# EAGLE design MultiGRADE_control_panel_V01_R1 (EAGLE 9.6.2)
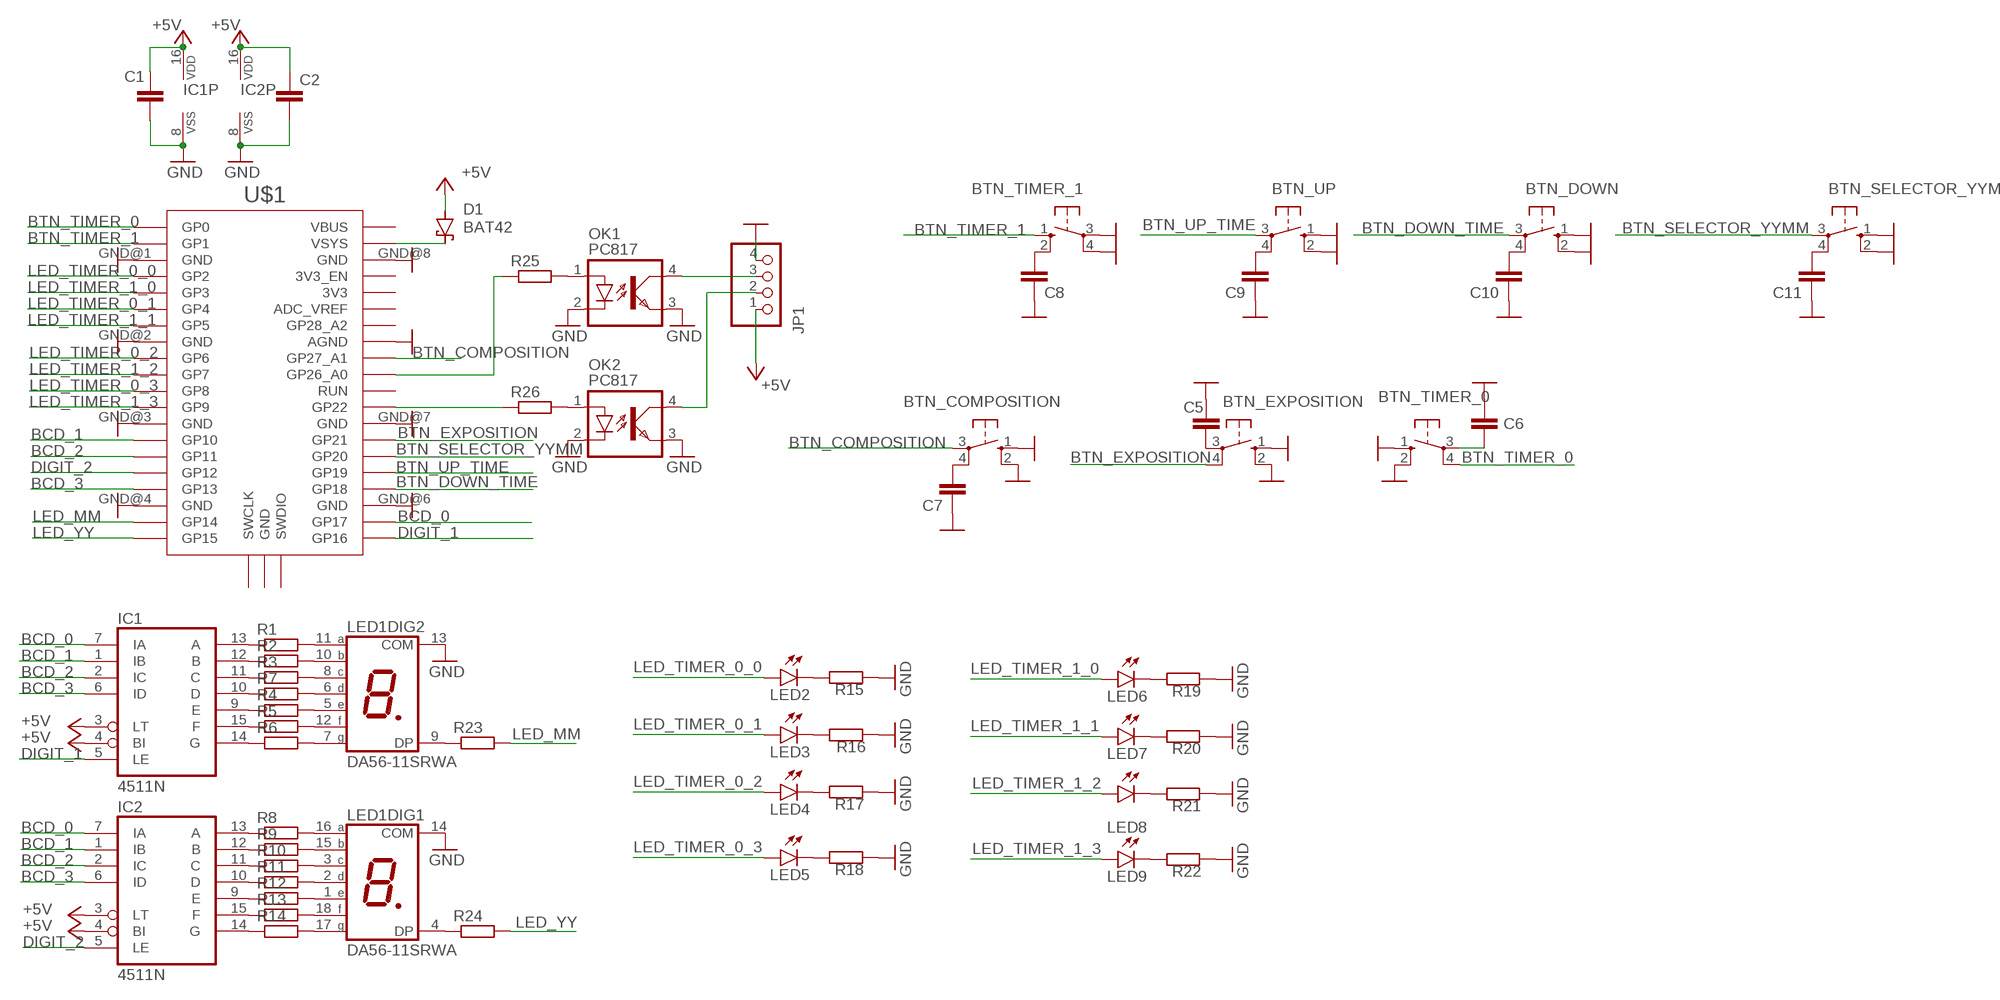
[diagram p0: schematic, sheet 1]

## Parts
BTN_COMPOSITION  10-XX  [B3F-10XX]
BTN_DOWN  10-XX  [B3F-10XX]
BTN_EXPOSITION  10-XX  [B3F-10XX]
BTN_SELECTOR_YYMM  10-XX  [B3F-10XX]
BTN_TIMER_0  10-XX  [B3F-10XX]
BTN_TIMER_1  10-XX  [B3F-10XX]
BTN_UP  10-XX  [B3F-10XX]
C1  C-EU050-025X075  [C050-025X075]
C2  C-EU050-025X075  [C050-025X075]
C5  C-EU025-025X050  [C025-025X050]
C6  C-EU025-025X050  [C025-025X050]
C7  C-EU025-025X050  [C025-025X050]
C8  C-EU025-025X050  [C025-025X050]
C9  C-EU025-025X050  [C025-025X050]
C10  C-EU025-025X050  [C025-025X050]
C11  C-EU025-025X050  [C025-025X050]
D1  BAT42  [DO35-10]
IC1  4511N  [DIL16]
IC2  4511N  [DIL16]
JP1  PINHD-1X4  [1X04]
LED1  DA56-11SRWA  [DA56]
LED2  LED3MM  [LED3MM]
LED3  LED3MM  [LED3MM]
LED4  LED3MM  [LED3MM]
LED5  LED3MM  [LED3MM]
LED6  LED3MM  [LED3MM]
LED7  LED3MM  [LED3MM]
LED8  LED3MM  [LED3MM]
LED9  LED3MM  [LED3MM]
OK1  PC817  [DIL04]
OK2  PC817  [DIL04]
R1  R-EU_0204/7  [0204/7]
R2  R-EU_0204/7  [0204/7]
R3  R-EU_0204/7  [0204/7]
R4  R-EU_0204/7  [0204/7]
R5  R-EU_0204/7  [0204/7]
R6  R-EU_0204/7  [0204/7]
R7  R-EU_0204/7  [0204/7]
R8  R-EU_0204/7  [0204/7]
R9  R-EU_0204/7  [0204/7]
R10  R-EU_0204/7  [0204/7]
R11  R-EU_0204/7  [0204/7]
R12  R-EU_0204/7  [0204/7]
R13  R-EU_0204/7  [0204/7]
R14  R-EU_0204/7  [0204/7]
R15  R-EU_0204/7  [0204/7]
R16  R-EU_0204/7  [0204/7]
R17  R-EU_0204/7  [0204/7]
R18  R-EU_0204/7  [0204/7]
R19  R-EU_0204/7  [0204/7]
R20  R-EU_0204/7  [0204/7]
R21  R-EU_0204/7  [0204/7]
R22  R-EU_0204/7  [0204/7]
R23  R-EU_0204/7  [0204/7]
R24  R-EU_0204/7  [0204/7]
R25  R-EU_0204/7  [0204/7]
R26  R-EU_0204/7  [0204/7]
U$1  RPI_PICO_IG-TH  [RPI_PICO_TH]

## Nets
+5V: C1.1 C2.1 D1.A IC1.3(LT) IC1.4(BI) IC1.16(VDD) IC2.3(LT) IC2.4(BI) IC2.16(VDD) JP1.1
BCD_0: IC1.7(IA) IC2.7(IA) U$1.GP17
BCD_1: IC1.1(IB) IC2.1(IB) U$1.GP10
BCD_2: IC1.2(IC) IC2.2(IC) U$1.GP11
BCD_3: IC1.6(ID) IC2.6(ID) U$1.GP13
BTN_COMPOSITION: BTN_COMPOSITION.3(P) U$1.GP27_A1
BTN_DOWN_TIME: BTN_DOWN.3(P) U$1.GP18
BTN_EXPOSITION: BTN_EXPOSITION.4(P1) U$1.GP21
BTN_SELECTOR_YYMM: BTN_SELECTOR_YYMM.3(P) U$1.GP20
BTN_TIMER_0: BTN_TIMER_0.4(P1) U$1.GP0
BTN_TIMER_1: BTN_TIMER_1.1(S) U$1.GP1
BTN_UP_TIME: BTN_UP.3(P) U$1.GP19
DIGIT_1: IC1.5(LE) U$1.GP16
DIGIT_2: IC2.5(LE) U$1.GP12
GND: BTN_COMPOSITION.1(S) BTN_COMPOSITION.2(S1) BTN_DOWN.1(S) BTN_DOWN.2(S1) BTN_EXPOSITION.1(S) BTN_EXPOSITION.2(S1) BTN_SELECTOR_YYMM.1(S) BTN_SELECTOR_YYMM.2(S1) BTN_TIMER_0.1(S) BTN_TIMER_0.2(S1) BTN_TIMER_1.3(P) BTN_TIMER_1.4(P1) BTN_UP.1(S) BTN_UP.2(S1) C1.2 C2.2 C5.1 C6.1 C7.1 C8.1 C9.1 C10.1 C11.1 IC1.8(VSS) IC2.8(VSS) JP1.4 LED1.13(DIG2:COM) LED1.14(DIG1:COM) OK1.2(C) OK1.3(EMIT) OK2.2(C) OK2.3(EMIT) R15.1 R16.1 R17.1 R18.1 R19.1 R20.1 R21.1 R22.1 U$1.AGND U$1.GND@1(GND) U$1.GND@2(GND) U$1.GND@3(GND) U$1.GND@4(GND) U$1.GND@6(GND) U$1.GND@7(GND) U$1.GND@8(GND)
LED_MM: R23.2 U$1.GP14
LED_TIMER_0_0: LED2.A U$1.GP2
LED_TIMER_0_1: LED3.A U$1.GP4
LED_TIMER_0_2: LED4.A U$1.GP6
LED_TIMER_0_3: LED5.A U$1.GP8
LED_TIMER_1_0: LED6.A U$1.GP3
LED_TIMER_1_1: LED7.A U$1.GP5
LED_TIMER_1_2: LED8.A U$1.GP7
LED_TIMER_1_3: LED9.A U$1.GP9
LED_YY: R24.2 U$1.GP15
N$1: IC1.13(A) R1.1
N$2: IC1.11(C) R3.1
N$3: IC1.15(F) R5.1
N$4: IC1.14(G) R6.1
N$5: IC1.10(D) R7.1
N$6: IC2.13(A) R8.1
N$7: IC2.12(B) R9.1
N$8: IC2.11(C) R10.1
N$9: IC2.10(D) R11.1
N$10: IC2.9(E) R12.1
N$11: IC2.15(F) R13.1
N$12: IC2.14(G) R14.1
N$13: LED1.16(DIG1:A) R8.2
N$14: LED1.15(DIG1:B) R9.2
N$15: LED1.3(DIG1:C) R10.2
N$16: LED1.2(DIG1:D) R11.2
N$17: LED1.1(DIG1:E) R12.2
N$18: LED1.18(DIG1:F) R13.2
N$19: LED1.17(DIG1:G) R14.2
N$20: IC1.9(E) R4.1
N$21: IC1.12(B) R2.1
N$22: LED1.11(DIG2:A) R1.2
N$23: LED1.10(DIG2:B) R2.2
N$24: LED1.8(DIG2:C) R3.2
N$25: LED1.5(DIG2:E) R4.2
N$26: LED1.12(DIG2:F) R5.2
N$27: LED1.7(DIG2:G) R6.2
N$28: LED1.6(DIG2:D) R7.2
N$29: LED2.K(C) R15.2
N$30: LED1.9(DIG2:DP) R23.1
N$31: BTN_EXPOSITION.3(P) C5.2
N$32: BTN_TIMER_0.3(P) C6.2
N$33: BTN_COMPOSITION.4(P1) C7.2
N$34: BTN_TIMER_1.2(S1) C8.2
N$35: BTN_UP.4(P1) C9.2
N$36: BTN_DOWN.4(P1) C10.2
N$37: BTN_SELECTOR_YYMM.4(P1) C11.2
N$38: LED1.4(DIG1:DP) R24.1
N$39: R25.1 U$1.GP26_A0
N$40: OK1.1(A) R25.2
N$41: OK2.1(A) R26.2
N$42: JP1.3 OK1.4(COL)
N$43: JP1.2 OK2.4(COL)
N$44: R26.1 U$1.GP22
N$45: D1.C U$1.VSYS
N$46: LED3.K(C) R16.2
N$47: LED4.K(C) R17.2
N$48: LED5.K(C) R18.2
N$49: LED6.K(C) R19.2
N$50: LED7.K(C) R20.2
N$51: LED8.K(C) R21.2
N$52: LED9.K(C) R22.2
Unconnected: U$1.3V3 U$1.3V3_EN U$1.ADC_VREF U$1.GND@5(GND) U$1.GP28_A2 U$1.RUN U$1.SWCLK U$1.SWDIO U$1.VBUS

## Library data of the parts
BTN_COMPOSITION BTN_DOWN BTN_EXPOSITION BTN_SELECTOR_YYMM BTN_TIMER_0 BTN_TIMER_1 BTN_UP = switch-omron:10-XX: OMRON SWITCH; MPN: B3F-1000; OC_FARNELL: 176432; OC_NEWARK: 36M3542
C1 C2 C5-C11 = rcl:C-EU: CAPACITOR, European symbol; SPICEPREFIX: C
D1 = diode:BAT42: DIODE barrier diode
IC1 IC2 = 45xx:4511: BCD to 7-segment LATCH/DECODER/DRIVER
JP1 = pinhead:PINHD-1X4: PIN HEADER
LED1 = display-kingbright:DA56-11: 14.22mm (0.56INCH) DUAL DIGIT NUMERIC DISPLAYS Source: www.kingbright.com .. DA56-11SRWA.pdf; OC_FARNELL: unknown; OC_NEWARK: unknown
LED2-LED9 = led:LED: LED OSRAM: - CHIPLED LG R971, LG N971, LY N971, LG Q971, LY Q971, LO R971, LY R971 LH N974, LH R974 LS Q976, LO Q976, LY Q976 LO Q996 - Hyper CHIPLED LW Q18S LB Q993, LB Q99A, LB R99A - SideLED LS A670, LO A670, LY A670, LG A670, LP A670 LB A673, LV A673, LT A673, LW A673 LH A674 LY A675 LS A676, LA A676, LO A676, LY A676, LW A676 LS A679, LY A679, LG A679 - Hyper Micro SIDELED® LS Y876, LA Y876, LO Y876, LY Y876 LT Y87S - SmartLED LW L88C, LW L88S LB L89C, LB L89S, LG L890 LS L89K, LO L89K, LY L89K LS L896, LA L896, LO L896, LY L896 - TOPLED LS T670, LO T670, LY T670, LG T670, LP T670 LSG T670, LSP T670, LSY T670, LOP T670, LYG T670 LG T671, LOG T671, LSG T671 LB T673, LV T673, LT T673, LW T673 LH T674 LS T676, LA T676, LO T676, LY T676, LB T676, LH T676, LSB T676, LW T676 LB T67C, LV T67C, LT T67C, LS T67K, LO T67K, LY T67K, LW E67C LS E67B, LA E67B, LO E67B, LY E67B, LB E67C, LV E67C, LT E67C LW T67C LS T679, LY T679, LG T679 LS T770, LO T770, LY T770, LG T770, LP T770 LB T773, LV T773, LT T773, LW T773 LH T774 LS E675, LA E675, LY E675, LS T675 LS T776, LA T776, LO T776, LY T776, LB T776 LHGB T686 LT T68C, LB T68C - Hyper Mini TOPLED® LB M676 - Mini TOPLED Santana® LG M470 LS M47K, LO M47K, LY M47K Source: http://www.osram.convergy.de LUXEON: - LUMILED® LXK2-PW12-R00, LXK2-PW12-S00, LXK2-PW14-U00, LXK2-PW14-V00 LXK2-PM12-R00, LXK2-PM12-S00, LXK2-PM14-U00 LXK2-PE12-Q00, LXK2-PE12-R00, LXK2-PE12-S00, LXK2-PE14-T00, LXK2-PE14-U00 LXK2-PB12-K00, LXK2-PB12-L00, LXK2-PB12-M00, LXK2-PB14-N00, LXK2-PB14-P00, LXK2-PB14-Q00 LXK2-PR12-L00, LXK2-PR12-M00, LXK2-PR14-Q00, LXK2-PR14-R00 LXK2-PD12-Q00, LXK2-PD12-R00, LXK2-PD12-S00 LXK2-PH12-R00, LXK2-PH12-S00 LXK2-PL12-P00, LXK2-PL12-Q00, LXK2-PL12-R00 Source: www.luxeon.com KINGBRIGHT: KA-3528ASYC Source: www.kingbright.com
OK1 OK2 = optocoupler:PC817: SHARP OPTO COUPLER; MPN: PC817X4J000F; OC_FARNELL: 9707727; OC_NEWARK: 97K7059
R1-R26 = rcl:R-EU_: RESISTOR, European symbol; SPICEPREFIX: R
U$1 = RaspberryPi_Pico:RPI_PICO_IG

## Board
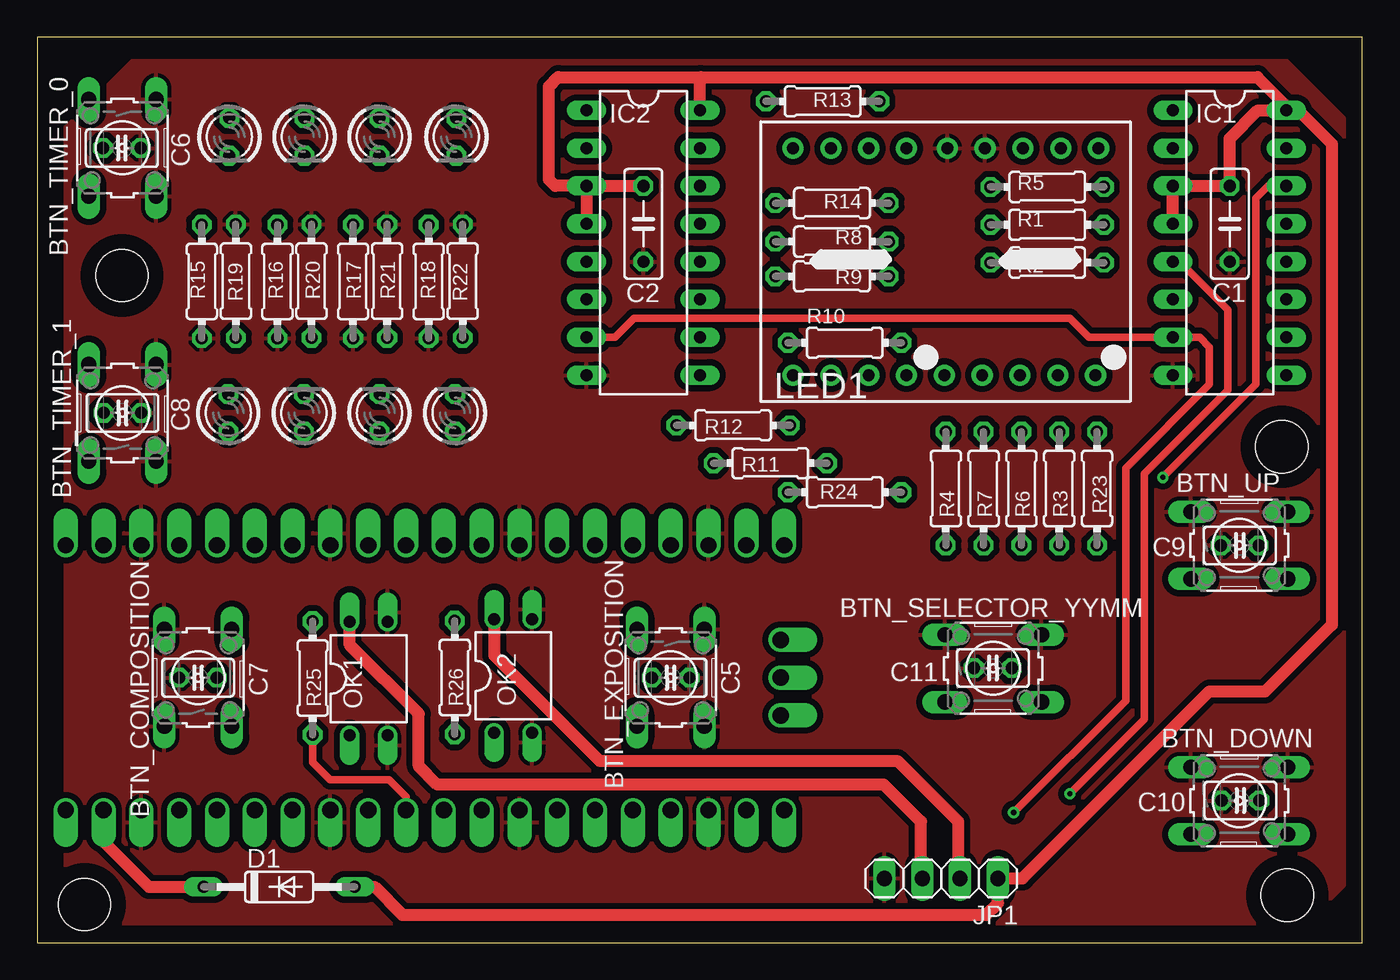
[diagram p1: board, top side]
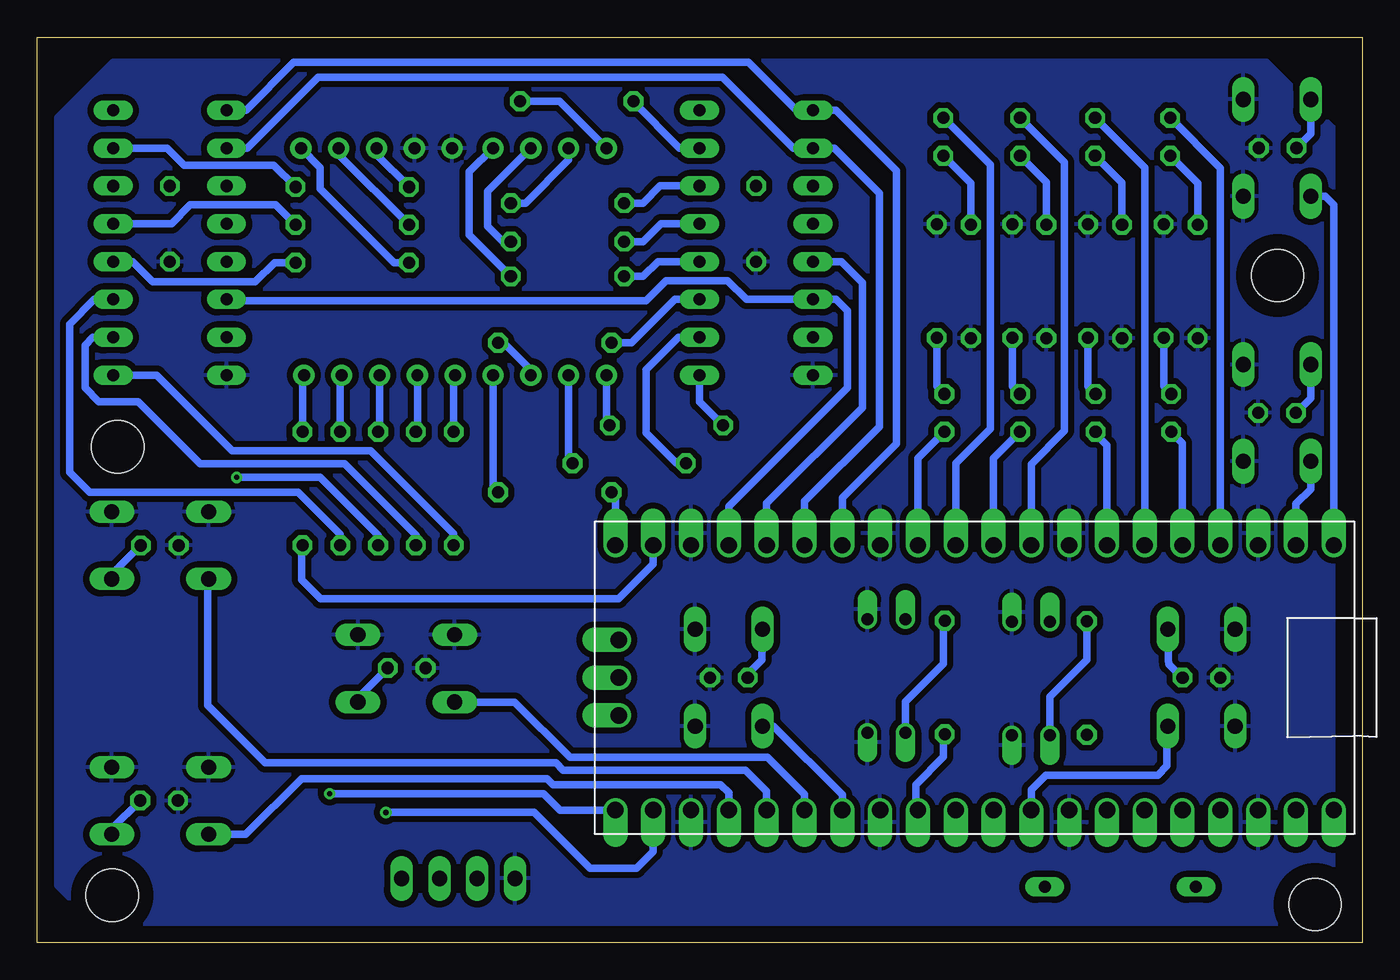
[diagram p2: board, bottom side, seen from below]

Size 89.02 x 60.81 mm. Coordinates in mm from the lower left corner, seen from the top.
Outline: 0,0 89.02,0 89.02,60.81 0,60.81 0,0
Copper layers (1*16): Top 0.035mm / dielectric 1.5mm / Bottom 0.035mm
Design rules "default": minimum track width 6mil, minimum drill 0.35mm, track to track 6mil, track to pad 6mil, pad to pad 6mil, via to via 6mil, smd to smd 6mil, copper to edge 40mil, drill to drill 6mil, minimum pad ring 10mil, minimum via ring 8mil, stop-mask expansion 4mil, vias tented up to drill 0mil, thermal gap 10mil
Holes 3.5 mm at 5.68,44.81 83.61,33.31 3.19,2.56 83.98,3.18

### Footprints (pad centres in the part's own frame; a part is rotated, then mirrored left to right if it is on the bottom)
B3F-10XX = drill 1.016 long: 1 -3.251,2.261; 2 3.251,2.261; 3 -3.251,-2.261; 4 3.251,-2.261
C050-025X075 = drill 0.813 octagon: 1 -2.54,0; 2 2.54,0
C025-025X050 = drill 0.813 octagon: 1 -1.27,0; 2 1.27,0
DO35-10 = drill 0.813 long: A 5.08,0; C -5.08,0
DIL16 = drill 0.813 long: 1 -8.89,-3.81; 2 -6.35,-3.81; 3 -3.81,-3.81; 4 -1.27,-3.81; 5 1.27,-3.81; 6 3.81,-3.81; 7 6.35,-3.81; 8 8.89,-3.81; 9 8.89,3.81; 10 6.35,3.81; 11 3.81,3.81; 12 1.27,3.81; 13 -1.27,3.81; 14 -3.81,3.81; 15 -6.35,3.81; 16 -8.89,3.81
1X04 = drill 1.016 long: 1 -3.81,0; 2 -1.27,0; 3 1.27,0; 4 3.81,0
DA56 = drill 0.8 pad 1.422: 1 -10.26,-7.62; 2 -7.72,-7.62; 3 -5.18,-7.62; 4 -2.64,-7.62; 5 -0.1,-7.62; 6 2.44,-7.62; 7 4.98,-7.62; 8 7.52,-7.62; 9 10.06,-7.62; 10 10.26,7.62; 11 7.72,7.62; 12 5.18,7.62; 13 2.64,7.62; 14 0.1,7.62; 15 -2.64,7.62; 16 -5.18,7.62; 17 -7.72,7.62; 18 -10.26,7.62
LED3MM = drill 0.813 octagon: A -1.27,0; K 1.27,0
DIL04 = drill 0.813 offset: 1 -1.27,-3.81; 2 1.27,-3.81; 3 1.27,3.81; 4 -1.27,3.81
0204/7 = drill 0.813 octagon: 1 -3.81,0; 2 3.81,0
RPI_PICO_TH = drill 1.1 pad 1.6 offset: 3V3 8.89,13.97; 3V3_EN 8.89,16.51; ADC_VREF 8.89,11.43; AGND 8.89,6.35; GND@1 -8.89,19.05; GND@2 -8.89,6.35; GND@3 -8.89,-6.35; GND@4 -8.89,-19.05; GND@5 0,-23.9; GND@6 8.89,-19.05; GND@7 8.89,-6.35; GND@8 8.89,19.05; GP0 -8.89,24.13; GP1 -8.89,21.59; GP2 -8.89,16.51; GP3 -8.89,13.97; GP4 -8.89,11.43; GP5 -8.89,8.89; GP6 -8.89,3.81; GP7 -8.89,1.27; GP8 -8.89,-1.27; GP9 -8.89,-3.81; GP10 -8.89,-8.89; GP11 -8.89,-11.43; GP12 -8.89,-13.97; GP13 -8.89,-16.51; GP14 -8.89,-21.59; GP15 -8.89,-24.13; GP16 8.89,-24.13; GP17 8.89,-21.59; GP18 8.89,-16.51; GP19 8.89,-13.97; GP20 8.89,-11.43; GP21 8.89,-8.89; GP22 8.89,-3.81; GP26_A0 8.89,1.27; GP27_A1 8.89,3.81; GP28_A2 8.89,8.89; RUN 8.89,-1.27; SWCLK -2.54,-23.9; SWDIO 2.54,-23.9; VBUS 8.89,24.13; VSYS 8.89,21.59

### Placement (x,y rotation side)
BTN_COMPOSITION  10.8,17.8 90 top
BTN_DOWN  80.75,9.54 0 top
BTN_EXPOSITION  42.55,17.8 270 top
BTN_SELECTOR_YYMM  64.22,18.43 0 top
BTN_TIMER_0  5.72,53.38 270 top
BTN_TIMER_1  5.72,35.58 90 top
BTN_UP  80.75,26.69 0 top
C1  80.11,48.28 270 top
C2  40.72,48.28 270 top
C5  42.55,17.8 180 top
C6  5.68,53.37 180 top
C7  10.8,17.8 0 top
C8  5.72,35.58 180 top
C9  80.79,26.68 0 top
C10  80.84,9.55 0 top
C11  64.2,18.45 0 top
D1  16.25,3.75 0 top
IC1  80.11,47.01 270 top
IC2  40.72,47.01 270 top
JP1  60.73,4.32 180 top
LED1  61.04,45.74 0 top
LED2  12.9,54.12 270 top
LED3  17.95,54.12 270 top
LED4  22.99,54.12 270 top
LED5  28.15,54.12 270 top
LED6  12.84,35.58 90 top
LED7  17.92,35.58 90 top
LED8  23,35.58 90 top
LED9  28.08,35.58 90 top
OK1  22.27,17.73 0 top
OK2  31.97,17.92 0 top
R1  67.86,48.22 180 top
R2  67.86,45.67 180 top
R3  68.66,30.5 90 top
R4  61.04,30.5 90 top
R5  67.86,50.76 180 top
R6  66.12,30.5 90 top
R7  63.58,30.5 90 top
R8  53.4,47.08 0 top
R9  53.4,44.75 0 top
R10  54.25,40.29 0 top
R11  49.25,32.2 0 top
R12  46.75,34.74 0 top
R13  52.77,56.51 0 top
R14  53.4,49.67 0 top
R15  11.06,44.41 90 top
R16  16.14,44.41 90 top
R17  21.22,44.41 90 top
R18  26.3,44.41 90 top
R19  13.35,44.43 270 top
R20  18.43,44.43 270 top
R21  23.5,44.43 270 top
R22  28.59,44.43 270 top
R23  71.2,30.5 270 top
R24  54.25,30.25 180 top
R25  18.5,17.77 90 top
R26  28.05,17.81 90 top
U$1  26.05,17.8 270 bottom

### Tracks (layer width: path | path; a pad name or v marks a point on that pad's centre or on a via)
+5V
  Top 0.813: IC1.4 IC1.3 C1.1 80.11,54.01 82,55.9 IC1.16 | IC2.3 IC2.4 | D1.A 22.65,3.75 24.53,1.88 63.75,1.88 64.54,2.67 JP1.1 66.19,4.32 78.75,16.88 82.5,16.88 86.97,21.35 86.97,53.65 84.72,55.9 IC1.16 | IC1.16 83.92,56.17 81.97,58.12 44.59,58.12 | IC2.3 C2.1 | IC2.3 34.8,50.82 34.38,51.25 34.38,57.5 35,58.12 44.59,58.12 | IC2.16 44.53,58.07 44.59,58.12
BCD_0  (via drill 0.35)
  Top 0.508: IC2.7 38.83,40.66 40.09,41.93 69.36,41.93 70.64,40.66 IC1.7 78.09,40.66 78.75,40 78.75,37.5 73.12,31.88 73.12,16.25 65.62,8.75 v65.59,8.75
  Bottom 0.508: U$1.GP17 47.63,6.12 48.75,5 51.88,5 55.62,8.75 v65.59,8.75
BCD_1
  Bottom 0.508: U$1.GP10 34.94,29.89 31.3,33.52 31.3,51.84 35.37,55.9 IC2.1 38,55.9 41.22,59.12 71.78,59.12 75,55.9 IC1.1
BCD_2
  Bottom 0.508: U$1.GP11 37.48,29.63 32.45,34.66 32.45,50.33 35.47,53.36 IC2.2 38.22,53.36 42.99,58.12 70.15,58.12 74.91,53.36 IC1.2
BCD_3
  Bottom 0.508: U$1.GP13 42.55,29.32 34.6,37.27 34.6,42.43 35.38,43.2 IC2.6 41.37,43.2 42.63,44.47 46.77,44.47 48.12,43.12 76.22,43.12 IC1.6
BTN_COMPOSITION
  Bottom 0.508: U$1.GP27_A1 22.23,10.27 21.25,11.25 13.75,11.25 13.12,11.88 13.12,14.49 BTN_COMPOSITION.3
BTN_DOWN_TIME
  Bottom 0.508: BTN_DOWN.3 75,7.27 71.25,11.02 54.77,11.02 54.38,10.62 43.12,10.62 42.55,10.05 U$1.GP18
BTN_EXPOSITION
  Bottom 0.508: U$1.GP21 34.94,9.94 39.55,14.55 BTN_EXPOSITION.4
BTN_SELECTOR_YYMM
  Bottom 0.508: U$1.GP20 37.48,9.97 39.96,12.46 53.24,12.46 56.95,16.16 BTN_SELECTOR_YYMM.3
BTN_TIMER_0
  Bottom 0.508: U$1.GP0 1.92,49.55 2.49,50.13 BTN_TIMER_0.4
BTN_TIMER_1
  Bottom 0.508: BTN_TIMER_1.1 3.46,30.45 4.46,29.46 U$1.GP1
BTN_UP_TIME
  Bottom 0.508: U$1.GP19 40.02,10.18 41.43,11.59 53.69,11.59 54.17,12.07 73.7,12.07 77.57,15.95 77.57,24.36 BTN_UP.3
DIGIT_1  (via drill 0.35)
  Top 0.508: IC1.5 76.76,45.74 80,42.5 80,37.11 74.38,31.49 74.38,15 v69.38,10
  Bottom 0.508: U$1.GP16 53.91,8.91 55,10 v69.38,10
DIGIT_2
  Bottom 0.508: IC2.5 34.99,45.74 33.59,44.33 33.59,35.93 40.02,29.5 U$1.GP12
GND
  pour Bottom (isolate 0.406): 6.37,59.23 83.98,59.23 87.77,55.44 87.77,3.83 85.23,1.29 4.46,1.29 1.92,3.83 1.92,54.77
  pour Top (isolate 0.406): 1.92,54.77 6.37,59.23 83.96,59.23 87.77,55.41 87.77,3.83 85.23,1.29 4.47,1.29 1.92,3.85
LED_MM
  Bottom 0.508: U$1.GP14 47.63,25.42 49.97,23.09 69.97,23.09 71.25,24.38 71.25,26.64 R23.2
LED_TIMER_0_0
  Bottom 0.508: LED2.A 9.54,52.02 U$1.GP2
LED_TIMER_0_1
  Bottom 0.508: U$1.GP4 14.62,52.05 LED3.A
LED_TIMER_0_2
  Bottom 0.508: U$1.GP6 22.23,32.14 20,34.38 20,52.4 LED4.A
LED_TIMER_0_3
  Bottom 0.508: U$1.GP8 27.32,32.2 25,34.51 25,52.24 LED5.A
LED_TIMER_1_0
  Bottom 0.508: LED6.A 12.07,33.55 U$1.GP3
LED_TIMER_1_1
  Bottom 0.508: LED7.A 17.92,34.18 17.16,33.42 U$1.GP5
LED_TIMER_1_2
  Bottom 0.508: U$1.GP7 24.77,32.53 LED8.A
LED_TIMER_1_3
  Bottom 0.508: U$1.GP9 29.86,32.53 LED9.A
LED_YY
  Bottom 0.508: U$1.GP15 50.17,29.98 R24.2
N$1
  Bottom 0.508: R1.1 73,49.55 78.75,49.55 80,48.3 80.02,48.28 IC1.13
N$2
  Bottom 0.508: R3.1 68.66,27.43 71.48,30.25 85.5,30.25 86.85,31.6 86.85,41.54 85.19,43.2 IC1.11
N$3
  Bottom 0.508: R5.1 73.13,52.22 79.13,52.22 80.27,53.36 IC1.15
N$4  (via drill 0.35)
  Top 0.508: v75.62,31.25 81.88,37.5 81.88,50 82.69,50.82 IC1.14
  Bottom 0.508: R6.1 66.12,27.36 70.01,31.25 v75.62,31.25
N$5
  Bottom 0.508: R7.1 63.58,27.36 68.38,32.15 78.06,32.15 82.23,36.33 84.88,36.33 85.81,37.26 85.81,40.13 85.28,40.66 IC1.10
N$6
  Bottom 0.508: IC2.13 47.12,48.28 48.31,47.08 R8.1
N$7
  Bottom 0.508: IC2.12 47.33,45.74 48.31,44.75 R9.1
N$8
  Bottom 0.508: IC2.11 46.17,43.2 49.09,40.29 R10.1
N$9
  Bottom 0.508: IC2.10 45.95,40.66 48.12,38.49 48.12,34.26 46.07,32.2 R11.1
N$10
  Bottom 0.508: R12.1 44.53,36.34 IC2.9
N$11
  Bottom 0.508: IC2.15 45.86,53.36 48.96,56.46 R13.1
N$12
  Bottom 0.508: IC2.14 47.16,50.82 48.31,49.67 R14.1
N$13
  Bottom 0.508: R8.2 57.71,47.08 58.75,48.12 58.75,50.47 LED1.16
N$14
  Bottom 0.508: LED1.15 60,51.76 60,47.55 R9.2
N$15
  Bottom 0.508: LED1.3 55.86,38.47 57.68,40.29 R10.2
N$16
  Bottom 0.508: LED1.2 53.32,32.47 R11.2
N$17
  Bottom 0.508: LED1.1 50.78,34.41 R12.2
N$18
  Bottom 0.508: LED1.18 53.92,56.51 R13.2
N$19
  Bottom 0.508: LED1.17 53.32,52.57 56.22,49.67 R14.2
N$20
  Bottom 0.508: R4.1 61.04,27.45 66.63,33.04 75.92,33.04 81,38.12 IC1.9
N$21
  Bottom 0.508: R2.1 73.08,45.67 74.38,44.38 81.25,44.38 82.61,45.74 IC1.12
N$22
  Bottom 0.508: R1.2 68.76,52.93 LED1.11
N$23
  Bottom 0.508: R2.2 65.05,45.67 70,50.62 70,52.06 LED1.10
N$24
  Bottom 0.508: LED1.8 68.66,38.02 R3.2
N$25
  Bottom 0.508: LED1.5 61.04,38.02 R4.2
N$26
  Bottom 0.508: R5.2 66.22,52.93 LED1.12
N$27
  Bottom 0.508: LED1.7 66.02,34.41 R6.2
N$28
  Bottom 0.508: LED1.6 63.48,34.41 R7.2
N$29
  Bottom 0.508: R15.2 11.06,51 LED2.K
N$30
  Bottom 0.508: LED1.9 71.2,38.02 R23.1
N$31
  Bottom 0.508: C5.2 41.28,18.05 40.32,19.02 40.32,21.03 BTN_EXPOSITION.3
N$32
  Bottom 0.508: C6.2 3.46,54.32 BTN_TIMER_0.3
N$33
  Bottom 0.508: BTN_COMPOSITION.4 13.04,21.03 13.04,19.02 12.98,18.71 C7.2
N$34
  Bottom 0.508: C8.2 3.46,36.57 BTN_TIMER_1.2
N$35
  Bottom 0.508: BTN_UP.4 84.01,24.73 C9.2
N$36
  Bottom 0.508: BTN_DOWN.4 84.01,7.65 C10.2
N$37
  Bottom 0.508: C11.2 67.48,16.44 BTN_SELECTOR_YYMM.4
N$38
  Bottom 0.508: LED1.4 58.4,30.59 R24.1
N$39
  Top 0.508: R25.1 18.5,12.12 19.68,10.94 23.63,10.94 24.77,9.8 U$1.GP26_A0
N$40
  Bottom 0.508: R25.2 18.5,19 21,16.5 OK1.1
N$41
  Bottom 0.508: R26.2 28.12,21.54 28.12,18.75 30.7,16.17 OK2.1
N$42
  Top 0.813: JP1.3 59.38,4.4 59.38,8.12 56.88,10.62 26.88,10.62 25.62,11.88 25.62,15.36 21,19.99 OK1.4
N$43
  Top 0.813: OK2.4 30.7,19.3 37.79,12.21 57.79,12.21 61.88,8.12 61.88,4.44 JP1.2
N$44
  Bottom 0.508: R26.1 28.12,13.92 28.12,12.5 30,10.62 30,9.05 U$1.GP22
N$45
  Top 0.813: U$1.VSYS 4.46,6.79 7.5,3.75 D1.C
N$46
  Bottom 0.508: R16.2 16.14,51.04 LED3.K
N$47
  Bottom 0.508: R17.2 21.22,51.08 LED4.K
N$48
  Bottom 0.508: R18.2 26.3,51 LED5.K
N$49
  Bottom 0.508: R19.2 13.35,37.36 LED6.K
N$50
  Bottom 0.508: R20.2 18.43,37.36 LED7.K
N$51
  Bottom 0.508: R21.2 23.5,37.36 LED8.K
N$52
  Bottom 0.508: R22.2 28.59,37.36 LED9.K

### Text on the board
tDocu: GND | OUT1 | OUT2 | 5V DC
bDocu: MultiGRADE v.1 | HPK @2024 | 2pkstartup.info